# Altium schematic sheet Ethernet.SchDoc: a_card
size A4; Author: 劉東輝; SheetNumber: 3; SheetTotal: 5; Unit: USB HUB; Edition: V1.5
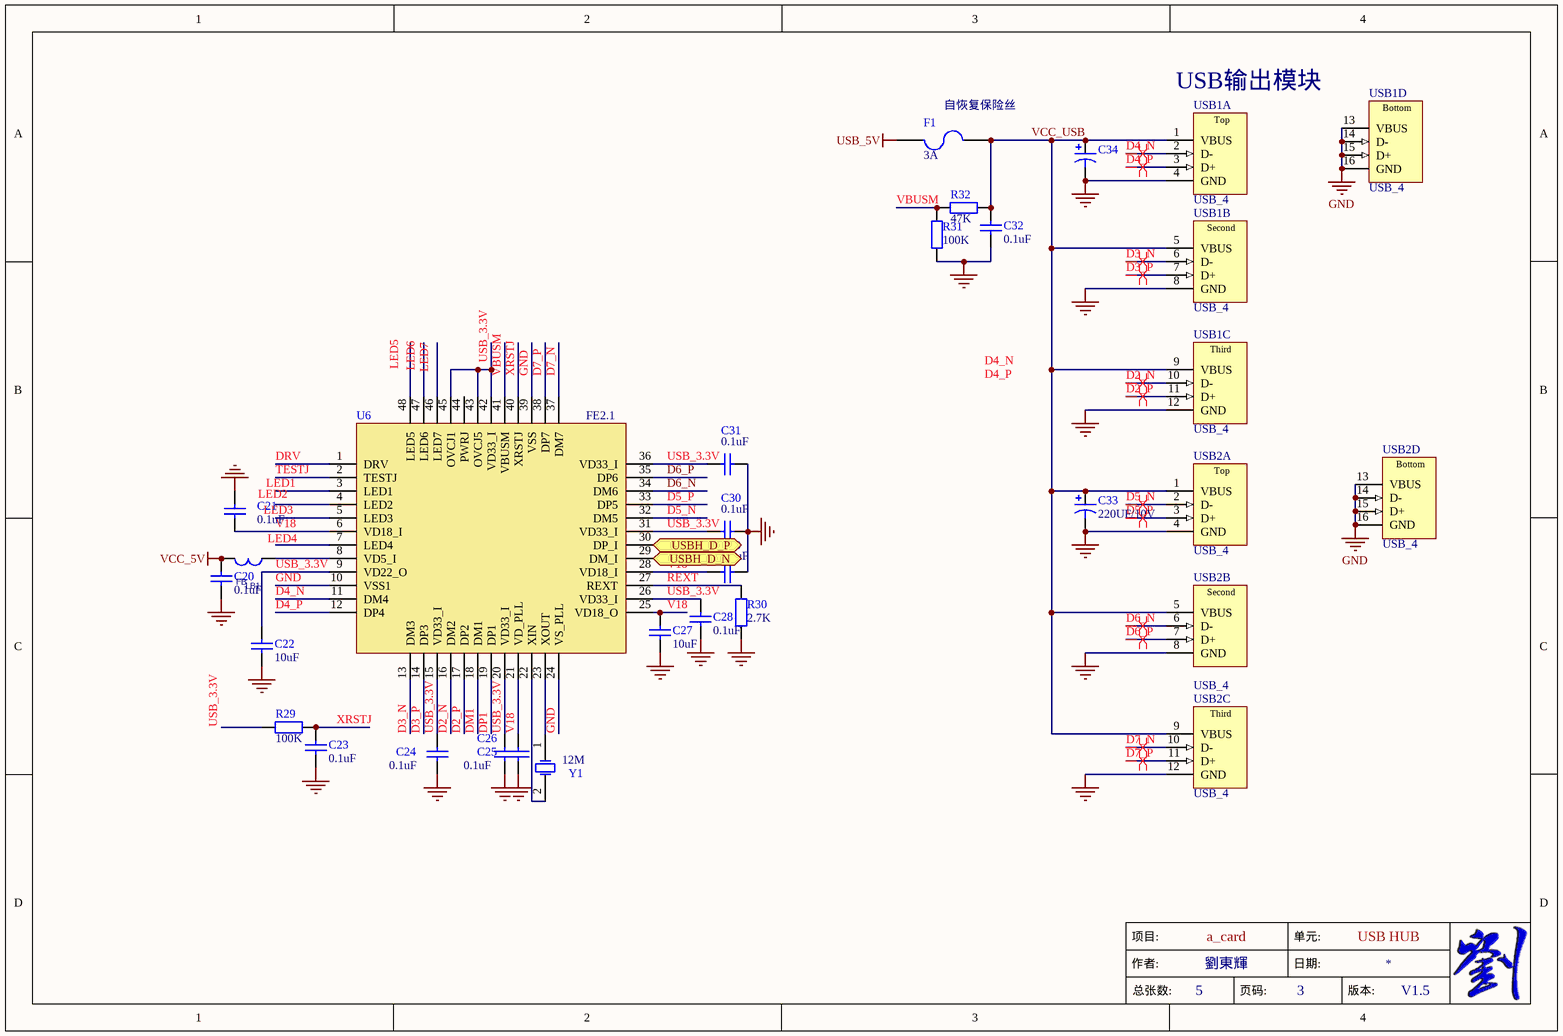
[diagram p0: Ethernet.SchDoc]

## Parts
C20  0.1uF  [0805/2012 C3]
C21  0.1uF  [0805/2012 C3]
C22  10uF  [0805/2012 C3]
C23  0.1uF  [0805/2012 C3]
C24  0.1uF  [0805/2012 C3]
C25  0.1uF  [0805/2012 C3]
C26  0.1uF  [0805/2012 C3]  (value not drawn)
C27  10uF  [0805/2012 C3]
C28  0.1uF  [0805/2012 C3]
C29  0.1uF  [0805/2012 C3]
C30  0.1uF  [0805/2012 C3]
C31  0.1uF  [0805/2012 C3]
C32  0.1uF  [0805/2012 C3]
C33  220UF/10V  [2312_6023-20_SMT-TAJ-F]
C34  220UF/10V  [2312_6023-20_SMT-TAJ-F]  (value not drawn)
F1  3A  [PPTC 1812/4532]
LB1  FB  [0805/2012 F3]
R29  100K  [0805/2012 R3]
R30  2.7K  [0805/2012 R3]
R31  100K  [0805/2012 R3]
R32  47K  [0805/2012 R3]
U6  FE2.1  [LQFP-48L]
USB1  USB_4  [USB-3]  (parts A,B,C,D of 5)
USB2  USB_4  [USB-3]  (parts A,B,C,D of 5)
Y1  12M  [XTAL_CITIZEN_HCM49]

## Ports
USBH_D_N (bidir), USBH_D_P (bidir)

## Nets
GND: C20.1 C21.1 C22.1 C23.1 C24.1 C25.1 C26.1 C27.1 C28.1 C29.1 C30.1 C31.1 C32.1 C33.2 C34.2 R30.1 R31.1 U6.10(VSS1) U6.24(VS_PLL) U6.39(VSS) USB1.4(GND) USB1.8(GND) USB1.12(GND) USB1.13(VBUS) USB1.14(D-) USB1.15(D+) USB1.16(GND) USB2.4(GND) USB2.8(GND) USB2.12(GND) USB2.13(VBUS) USB2.14(D-) USB2.15(D+) USB2.16(GND)
USB_5V: F1.2
VCC_5V: C20.2 LB1.2
D2_N: U6.16(DM2) USB1.10(D-)
D2_P: U6.17(DP2) USB1.11(D+)
D3_N: U6.13(DM3) USB1.6(D-)
D3_P: U6.14(DP3) USB1.7(D+)
D4_N: U6.11(DM4) USB1.2(D-)
D4_P: U6.12(DP4) USB1.3(D+)
D5_N: U6.32(DM5) USB2.2(D-)
D5_P: U6.33(DP5) USB2.3(D+)
D6_N: U6.34(DM6) USB2.6(D-)
D6_P: U6.35(DP6) USB2.7(D+)
D7_N: U6.37(DM7) USB2.10(D-)
D7_P: U6.38(DP7) USB2.11(D+)
DM1: U6.18(DM1)
DP1: U6.19(DP1)
DRV: U6.1(DRV)
REXT: R30.2 U6.27(REXT)
TESTJ: U6.2(TESTJ)
USB_3.3V: C22.2 C24.2 C25.2 C28.2 C30.2 C31.2 R29.1 U6.9(VD22_O) U6.15(VD33_I) U6.20(VD33_I) U6.26(VD33_I) U6.31(VD33_I) U6.36(VD33_I) U6.42(VD33_I) U6.43(OVCJ5) U6.45(OVCJ1)
USBH_D_N: U6.29(DM_I) ; port USBH_D_N
USBH_D_P: U6.30(DP_I) ; port USBH_D_P
V18: C21.2 C26.2 C27.2 C29.2 U6.6(VD18_I) U6.21(VD_PLL) U6.25(VD18_O) U6.28(VD18_I)
VBUSM: R31.2 R32.2 U6.41(VBUSM)
VCC_USB: C32.2 C33.1 C34.1 F1.1 R32.1 USB1.1(VBUS) USB1.5(VBUS) USB1.9(VBUS) USB2.1(VBUS) USB2.5(VBUS) USB2.9(VBUS)
XRSTJ: C23.2 R29.2 U6.40(XRSTJ)
NetLB1_1: LB1.1 U6.8(VD5_I)
NetU6_22: U6.22(XIN) Y1.2(OSC2)
NetU6_23: U6.23(XOUT) Y1.1(OSC1)

Not connected (* = marked no-connect by the designer): U6 3(LED1) 4(LED2) 5(LED3) 7(LED4) 44(PWRJ) 46(LED7) 47(LED6) 48(LED5)

## Layout directives
differential pair: D2_N, D2_P, D3_N, D3_P, D4_N, D4_P, D5_N, D5_P, D6_N, D6_P, D7_N, D7_P

## Notes on the sheet
- (near F1) 自恢复保险丝
- (near USB1) USB输出模块
- Labels drawn without touching a wire or pin: D4_N, D4_P, LED1, LED2, LED3, LED4, LED5, LED6, LED7
- 项目:
- 作者:
- 总张数:
- 页码:
- 日期:
- 单元:
- 版本:
- (in symbol USB_4, part A) Top
- (in symbol USB_4, part B) Second
- (in symbol USB_4, part C) Third
- (in symbol USB_4, part D) Bottom

## Library data of the parts
C20-C32 = Cap: Capacitor
  C20-C22 C24 C27 C30: Published: *; LatestRevisionDate: *; LatestRevisionNote: *; PackageReference: *; Publisher: *; Value: *
  C23 C25 C26 C28 C29 C31 C32: Published: 8-Jun-2000; LatestRevisionDate: 17-Jul-2002; LatestRevisionNote: Re-released for DXP Platform.; PackageReference: RAD-0.3; Publisher: Altium Limited
C33 C34 = Cap Pol1: Polarized Capacitor (Radial)
  C33: Published: 8-Jun-2000; LatestRevisionDate: 17-Jul-2002; LatestRevisionNote: Re-released for DXP Platform.; PackageReference: RB7.6-15; Publisher: Altium Limited
  C34: Published: *; LatestRevisionDate: *; LatestRevisionNote: *; PackageReference: *; Publisher: *; Value: *
F1 = Fuse 2: Fuse; Published: 8-Jun-2000; LatestRevisionDate: 17-Jul-2002; LatestRevisionNote: Re-released for DXP Platform.; PackageReference: PIN-W2/E2.8; Publisher: Altium Limited
LB1 = FB-0805
R29-R32 = Res2: Resistor
  R29 R31 R32: Published: 8-Jun-2000; LatestRevisionDate: 17-Jul-2002; LatestRevisionNote: Re-released for DXP Platform.; PackageReference: AXIAL-0.4; Publisher: Altium Limited
  R30: Published: *; LatestRevisionDate: *; LatestRevisionNote: *; PackageReference: *; Publisher: *; Value: *
U6 = F2.1
USB1 USB2 = USB_4: USB 1.1, Right Angle, Thru-Hole, A Type, Receptacle, 4x4x4x4 Position, Fourfold Stacked, Black; ContactMaterial: Phosphor Bronze; ContactPlating: Gold (30) over Nickel (50); TerminationLength: 2.36mm [0.093in.]; PCB_Layout: Complies with manufacturer's recommendation.; DrillSize: Corresponds to nominal value.; PanelGround: Without; Published: 15-Jul-2004; DatasheetDocument: 30-Jul-2002; PackageDocument: 30-Jul-2002; PackageReference: 1470007; Publisher: Altium Limited; HousingMaterial: 30% Glass-Filled Thermoplastic; ComponentLink1Description: Manufacturer Link; ComponentLink1URL: http://www.tycoelectronics.com/; ComponentLink2Description: Packaging Specification; ComponentLink2URL: http://ecommas.tycoelectronics.com/commerce/DocumentDelivery/DDEController?Action=showdoc&DocId=Customer+Drawing%7F1470007%7FO%7Fpdf%7FEnglish%7FENG_CD_1470007_O.pdf
Y1 = XTAL: Crystal Oscillator; Published: *; LatestRevisionDate: *; LatestRevisionNote: *; PackageReference: *; Publisher: *